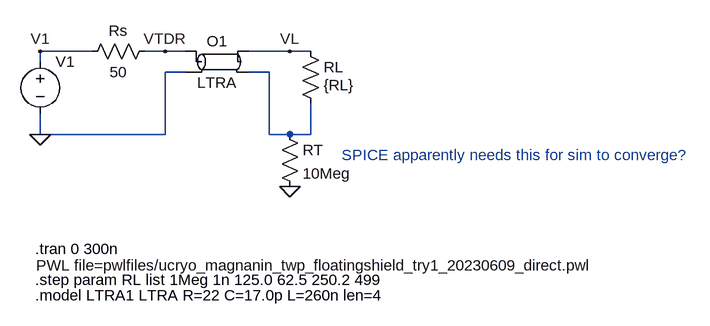
[diagram p0: schematic tdr_4ftucryomanginintwp_floatingshield.asc]
tdr_4ftucryomanginintwp_floatingshield.asc, the LTspice schematic file:
Version 4
SHEET 1 1272 680
WIRE 16 144 -64 144
WIRE 128 144 96 144
WIRE 160 144 128 144
WIRE 320 144 256 144
WIRE 352 144 320 144
WIRE -64 160 -64 144
WIRE 160 176 128 176
WIRE 288 176 256 176
WIRE -64 272 -64 240
WIRE 128 272 128 176
WIRE 128 272 -64 272
WIRE 288 272 288 176
WIRE 320 272 288 272
WIRE 352 272 352 224
WIRE 352 272 320 272
FLAG -64 272 0
FLAG 320 144 VL
FLAG -64 144 V1
FLAG 128 144 VTDR
FLAG 320 352 0
SYMBOL res 112 128 R90
WINDOW 0 0 56 VBottom 2
WINDOW 3 32 56 VTop 2
SYMATTR InstName Rs
SYMATTR Value 50
SYMBOL voltage -64 144 R0
WINDOW 123 0 0 Left 0
WINDOW 39 0 0 Left 0
WINDOW 3 -6 330 Left 2
SYMATTR Value PWL file=pwlfiles/ucryo_magnanin_twp_floatingshield_try1_20230609_direct.pwl
SYMATTR InstName V1
SYMBOL res 336 128 R0
WINDOW 3 36 68 Left 2
SYMATTR Value {RL}
SYMATTR InstName RL
SYMBOL ltline 208 160 R0
SYMATTR InstName O1
SYMATTR SpiceModel LTRA1
SYMBOL res 304 256 R0
SYMATTR InstName RT
SYMATTR Value 10Meg
TEXT -72 448 Left 2 !.tran 0 300n
TEXT -72 520 Left 2 !.model LTRA1 LTRA R=22 C=17.0p L=260n len=4
TEXT -72 496 Left 2 !.step param RL list 1Meg 1n 125.0 62.5 250.2 499
TEXT 400 304 Left 2 ;SPICE apparently needs this for sim to converge?

The netlist it stands for:
* tdr_4ftucryomanginintwp_floatingshield.asc
Rs VTDR V1 50
V1 V1 0 PWL file=pwlfiles/ucryo_magnanin_twp_floatingshield_try1_20230609_direct.pwl
RL VL N001 {RL}
O1 VTDR 0 VL N001 LTRA1 LTRA
RT N001 0 10Meg
.tran 0 300n
.model LTRA1 LTRA R=22 C=17.0p L=260n len=4
.step param RL list 1Meg 1n 125.0 62.5 250.2 499
* SPICE apparently needs this for sim to converge?
.backanno
.end